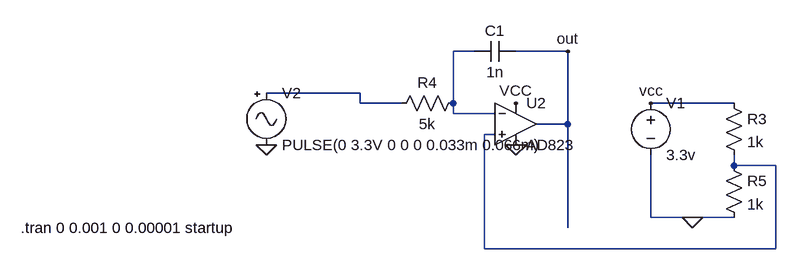
[diagram p0: schematic triangle_gen.asc]
triangle_gen.asc, the LTspice schematic file:
Version 4
SHEET 1 888 680
WIRE 368 80 336 80
WIRE 512 80 432 80
WIRE 192 144 48 144
WIRE 192 160 192 144
WIRE 256 160 192 160
WIRE 336 160 336 80
WIRE 768 160 640 160
WIRE 336 176 336 160
WIRE 400 176 336 176
WIRE 512 192 512 80
WIRE 512 192 464 192
WIRE 400 208 384 208
WIRE 768 256 768 240
WIRE 832 256 768 256
WIRE 640 336 640 240
WIRE 704 336 640 336
WIRE 768 336 704 336
WIRE 512 352 512 192
WIRE 384 384 384 208
WIRE 832 384 832 256
WIRE 832 384 384 384
FLAG 640 160 vcc
FLAG 432 160 VCC
FLAG 432 224 0
FLAG 512 80 out
FLAG 704 336 0
FLAG 48 224 0
SYMBOL voltage 640 144 R0
WINDOW 123 0 0 Left 0
WINDOW 39 0 0 Left 0
SYMATTR InstName V1
SYMATTR Value 3.3v
SYMBOL res 352 144 R90
WINDOW 0 0 56 VBottom 2
WINDOW 3 32 56 VTop 2
SYMATTR InstName R4
SYMATTR Value 5k
SYMBOL cap 432 64 R90
WINDOW 0 0 32 VBottom 2
WINDOW 3 32 32 VTop 2
SYMATTR InstName C1
SYMATTR Value 1n
SYMBOL OpAmps\\AD823 432 128 R0
SYMATTR InstName U2
SYMBOL res 752 144 R0
SYMATTR InstName R3
SYMATTR Value 1k
SYMBOL res 752 240 R0
SYMATTR InstName R5
SYMATTR Value 1k
SYMBOL Misc\\signal 48 128 R0
WINDOW 123 0 0 Left 0
WINDOW 39 0 0 Left 0
SYMATTR InstName V2
SYMATTR Value PULSE(0 3.3V 0 0 0 0.033m 0.066m)
TEXT -330 352 Left 2 !.tran 0 0.001 0 0.00001 startup

The netlist it stands for:
* triangle_gen.asc
V1 vcc 0 3.3v
R4 N001 N002 5k
C1 out N001 1n
XU2 N003 N001 vcc 0 out AD823  ; pins In+ In- V+ V- OUT
R3 vcc N003 1k
R5 N003 0 1k
V2 N002 0 PULSE(0 3.3V 0 0 0 0.033m 0.066m)
.tran 0 0.001 0 0.00001 startup
.lib ADI.lib
.backanno
.end

* Results of the author's LTspice run, read from the files saved beside the schematic
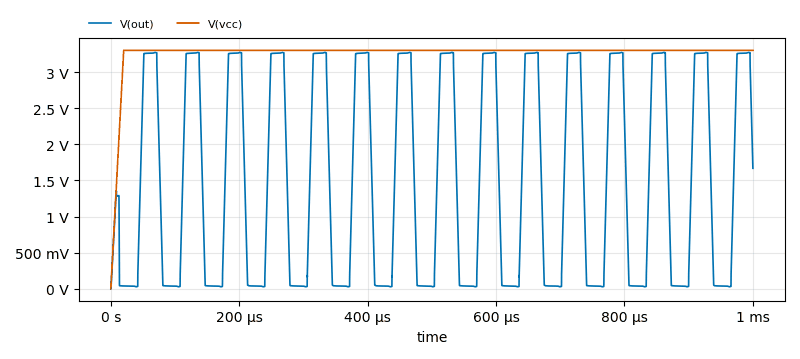
[diagram p1: Transient Analysis of triangle_gen.asc, plotted from the saved traces]
* Transient Analysis, 1 run:
*   V(out): min 0 V, max 3.272 V, average 1.478 V, rms 2.073 V, last 1.668 V
*   V(vcc): min 0 V, max 3.3 V, average 3.267 V, rms 3.278 V, last 3.3 V